# Altium schematic sheet Sheet1.SchDoc
size A4
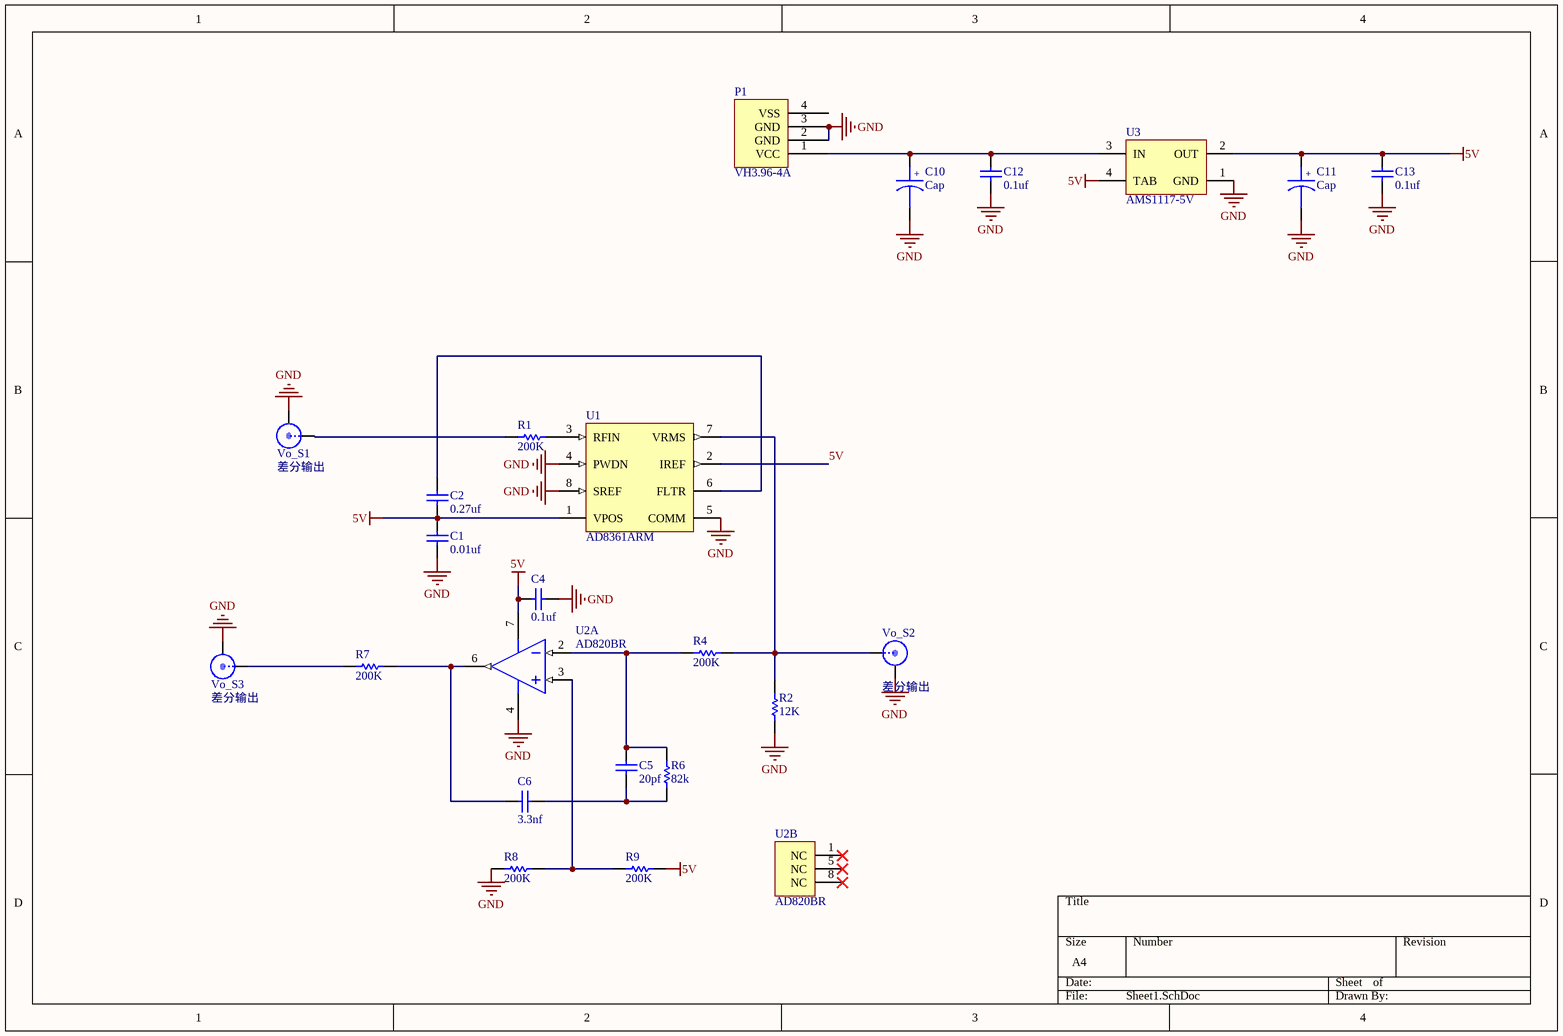
[diagram p0: Sheet1.SchDoc]

## Parts
C1  0.01uf  [0603C]
C2  0.27uf  [0603C]
C4  0.1uf  [0603C]
C5  20pf  [0603C]
C6  3.3nf  [0603C]
C10  Cap  [3216C-TYPE_A]
C11  Cap  [3216C-TYPE_A]
C12  0.1uf  [0805]
C13  0.1uf  [0805]
P1  VH3.96-4A  [VH3.96-4P]
R1  200K  [0603R]
R2  12K  [0603R]
R4  200K  [0603R]
R6  82k  [0603R]
R7  200K  [0603R]
R8  200K  [0603R]
R9  200K  [0603R]
U1  AD8361ARM  [ADI-RM-8_N]
U2  AD820BR  [ADI-R-8_N]  (parts A,B of 2)
U3  AMS1117-5V  [SOT-223]
Vo_S1  差分输出  [SMA-LYING]
Vo_S2  差分输出  [SMA-LYING]
Vo_S3  差分输出  [SMA-LYING]

## Nets
5V: C1.2 C2.1 C4.1 C11.1 C13.2 R9.2 U1.1(VPOS) U1.2(IREF) U2.7(+VS) U3.2(OUT) U3.4(TAB)
GND: C1.1 C4.2 C10.2 C11.2 C12.1 C13.1 P1.2(GND) P1.3(GND) R2.1 R8.1 U1.4(PWDN) U1.5(COMM) U1.8(SREF) U2.4(-VS) U3.1(GND) Vo_S1.1 Vo_S2.1 Vo_S3.1
NetC2_2: C2.2 U1.6(FLTR)
NetC5_1: C5.1 C6.1 R6.1
NetC5_2: C5.2 R4.1 R6.2 U2.2(-IN)
NetC6_2: C6.2 R7.1 U2.6(VOUT)
NetC10_1: C10.1 C12.2 P1.1(VCC) U3.3(IN)
NetR1_1: R1.1 Vo_S1.0
NetR1_2: R1.2 U1.3(RFIN)
NetR2_2: R2.2 R4.2 U1.7(VRMS) Vo_S2.0
NetR7_2: R7.2 Vo_S3.0
NetR8_2: R8.2 R9.1 U2.3(+IN)

Not connected (* = marked no-connect by the designer): P1 4(VSS); U2 1(NC)* 5(NC)* 8(NC)*

## Notes on the sheet
- (in symbol Tantalium Cap) +

## Library data of the parts
C1 C2 C4-C6 C12 C13 = Cap
C10 C11 = Tantalium Cap
R1 R2 R4 R6-R9 = Res
U1 = AD8361ARM: LF to 2.5 GHz TruPwr?Detector, 5祍 Response Time, RM-8, 50 Tube; Product Description: Low Power RMS Detector; RF Frequency (MHz): 2.5GHz; Dynamic Range (dB): 30dB; Temp Stability (dB): 250mdB; Voltage Supply (V): 2.7 to 5.5; Supply Current: 1.1mA; Output Response: Linear in Voltage; DatasheetVersion: Rev. C; PackageVersion: Aug-2005; PackageReference: RM-8; PackageDescription: 8-Lead Mini Small Outline Package [MSOP]; Response Time (ns typ): 5祍; Code_JEDEC: MO-187-AA; ComponentLink1Description: Manufacturer URL; ComponentLink1URL: www.analog.com; ComponentLink2Description: Datasheet; ComponentLink2URL: http://www.analog.com/static/imported-files/data_sheets/AD8361.pdf; ComponentLink3Description: Package Specification; ComponentLink3URL: http://www.analog.com/static/imported-files/packages/PKG_PDF/MSOP%28RM%29/RM_8.pdf
U2 = AD820BR: Single Channel Rail-to-Rail Operational Amplifier, 1.9 MHz BW, 3 V/us SR, Industrial, 8-pin SOIC (R-8), Tube; Generic Part Number: AD820; Manufacturer: Analog Devices; Amplifiers Per Package: 1; Input Bias Current: 2pA; Input Offset Voltage: 100uV; Iq/Amp: 900uA; Slew Rate: 3V/us; Small Signal Bandwidth: 1.9MHz; V Span Max: 36V; V Span Min: 5V; DatasheetVersion: Rev. H; PackageVersion: 060506-A; PackageReference: R-8; PackageDescription: 8-Pin Standard Small Outline Package, Body 3.9 x 4.9 mm, Pitch 1.27 mm; Supplier 1: Digi-Key; Supplier Part Number 1: AD820BR-ND; Mounting Technology: Surface Mount; Code_JEDEC: MS-012-AA; PartNumber: AD820BR; ComponentLink1Description: Manufacturer URL; ComponentLink1URL: http://www.analog.com/en/index.html; ComponentLink2Description: Datasheet; ComponentLink2URL: http://www.analog.com/static/imported-files/data_sheets/AD820.pdf; ComponentLink3Description: Package Specification; ComponentLink3URL: http://www.analog.com/static/imported-files/packages/PKG_PDF/SOIC_Narrow%20(R)/R_8.pdf
U3 = AMS1117-3.3V
Vo_S1-Vo_S3 = SMA